# EAGLE schematic Jeep_Windshield_Light (EAGLE 8.5.0)
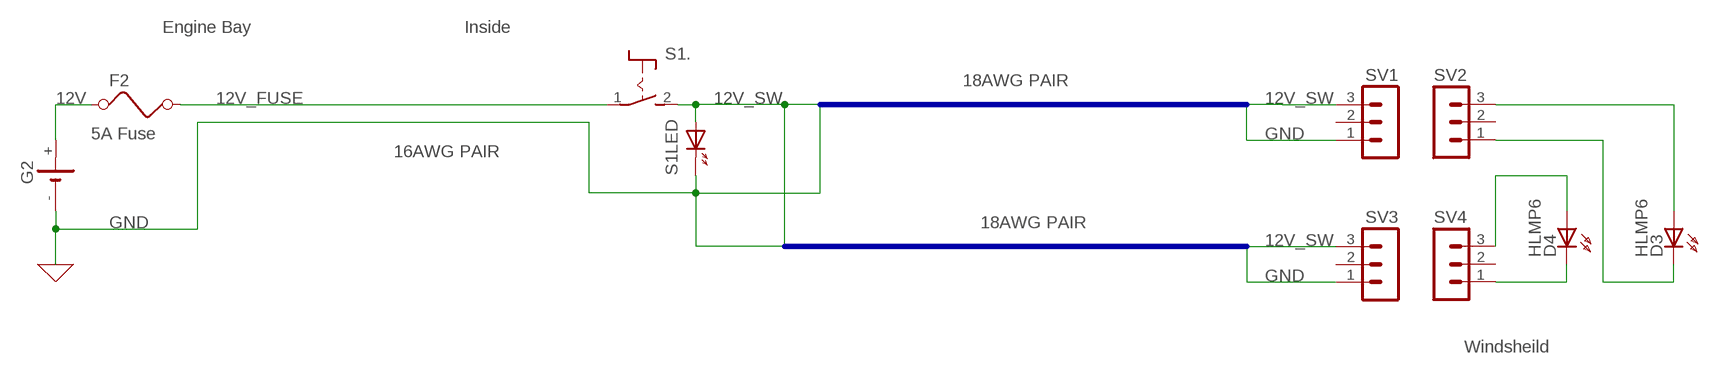
[diagram p0: schematic, sheet 1]

## Parts
D3  HLMP6  [HLMP6]
D4  HLMP6  [HLMP6]
F2  FUSE  [FUSE]
G2  SL340B  [SL-340/B3.6V]
S1  MARQ6425  [MARQ6425]
SV1  MA03-1  [MA03-1]
SV2  MA03-1  [MA03-1]
SV3  MA03-1  [MA03-1]
SV4  MA03-1  [MA03-1]

## Nets
12V: F2.1 G2.+
12V_FUSE: F2.2 S1.1(.:P)
12V_SW: S1.2(.:S) S1.A(LED:A) SV1.3 SV3.3
GND: G2.- SV1.1 SV3.1
N$2: D4.A SV4.3
N$3: D3.A SV2.3
N$4: D4.K SV4.1
N$5: D3.K SV2.1
Unconnected: S1.K(LED:K) SV1.2 SV2.2 SV3.2 SV4.2

## Buses
12V_SW,GND

## Notes on the sheet
- Engine Bay | Inside
- 18AWG PAIR
- 5A Fuse
- 16AWG PAIR
- 18AWG PAIR
- Windsheild

## Library data of the parts
D3 D4 = display-hp:HLMP6: LED 2mm horizontal; MF: AGILENT TECHNOLOGIES; MPN: HLMP-6500; OC_FARNELL: 1652490; OC_NEWARK: 40K0088
F2 = special:FUSE: FUSE 5 x 20 mm
G2 = battery:SL340B: LI BATTERY Sonnenschein SL-340 B 3.6 V
S1 = switch:MARQ6425: DIL SWITCH with LED, Marquardt
SV1-SV4 = con-lstb:MA03-1: PIN HEADER; OC_FARNELL: unknown; OC_NEWARK: unknown